# Altium schematic sheet Microcontroller.SchDoc
size A3; Organization: Altium Limited; Address1: L3, 12a Rodborough Rd; Address2: Frenchs Forest; Address3: NSW; Address4: Australia 2086
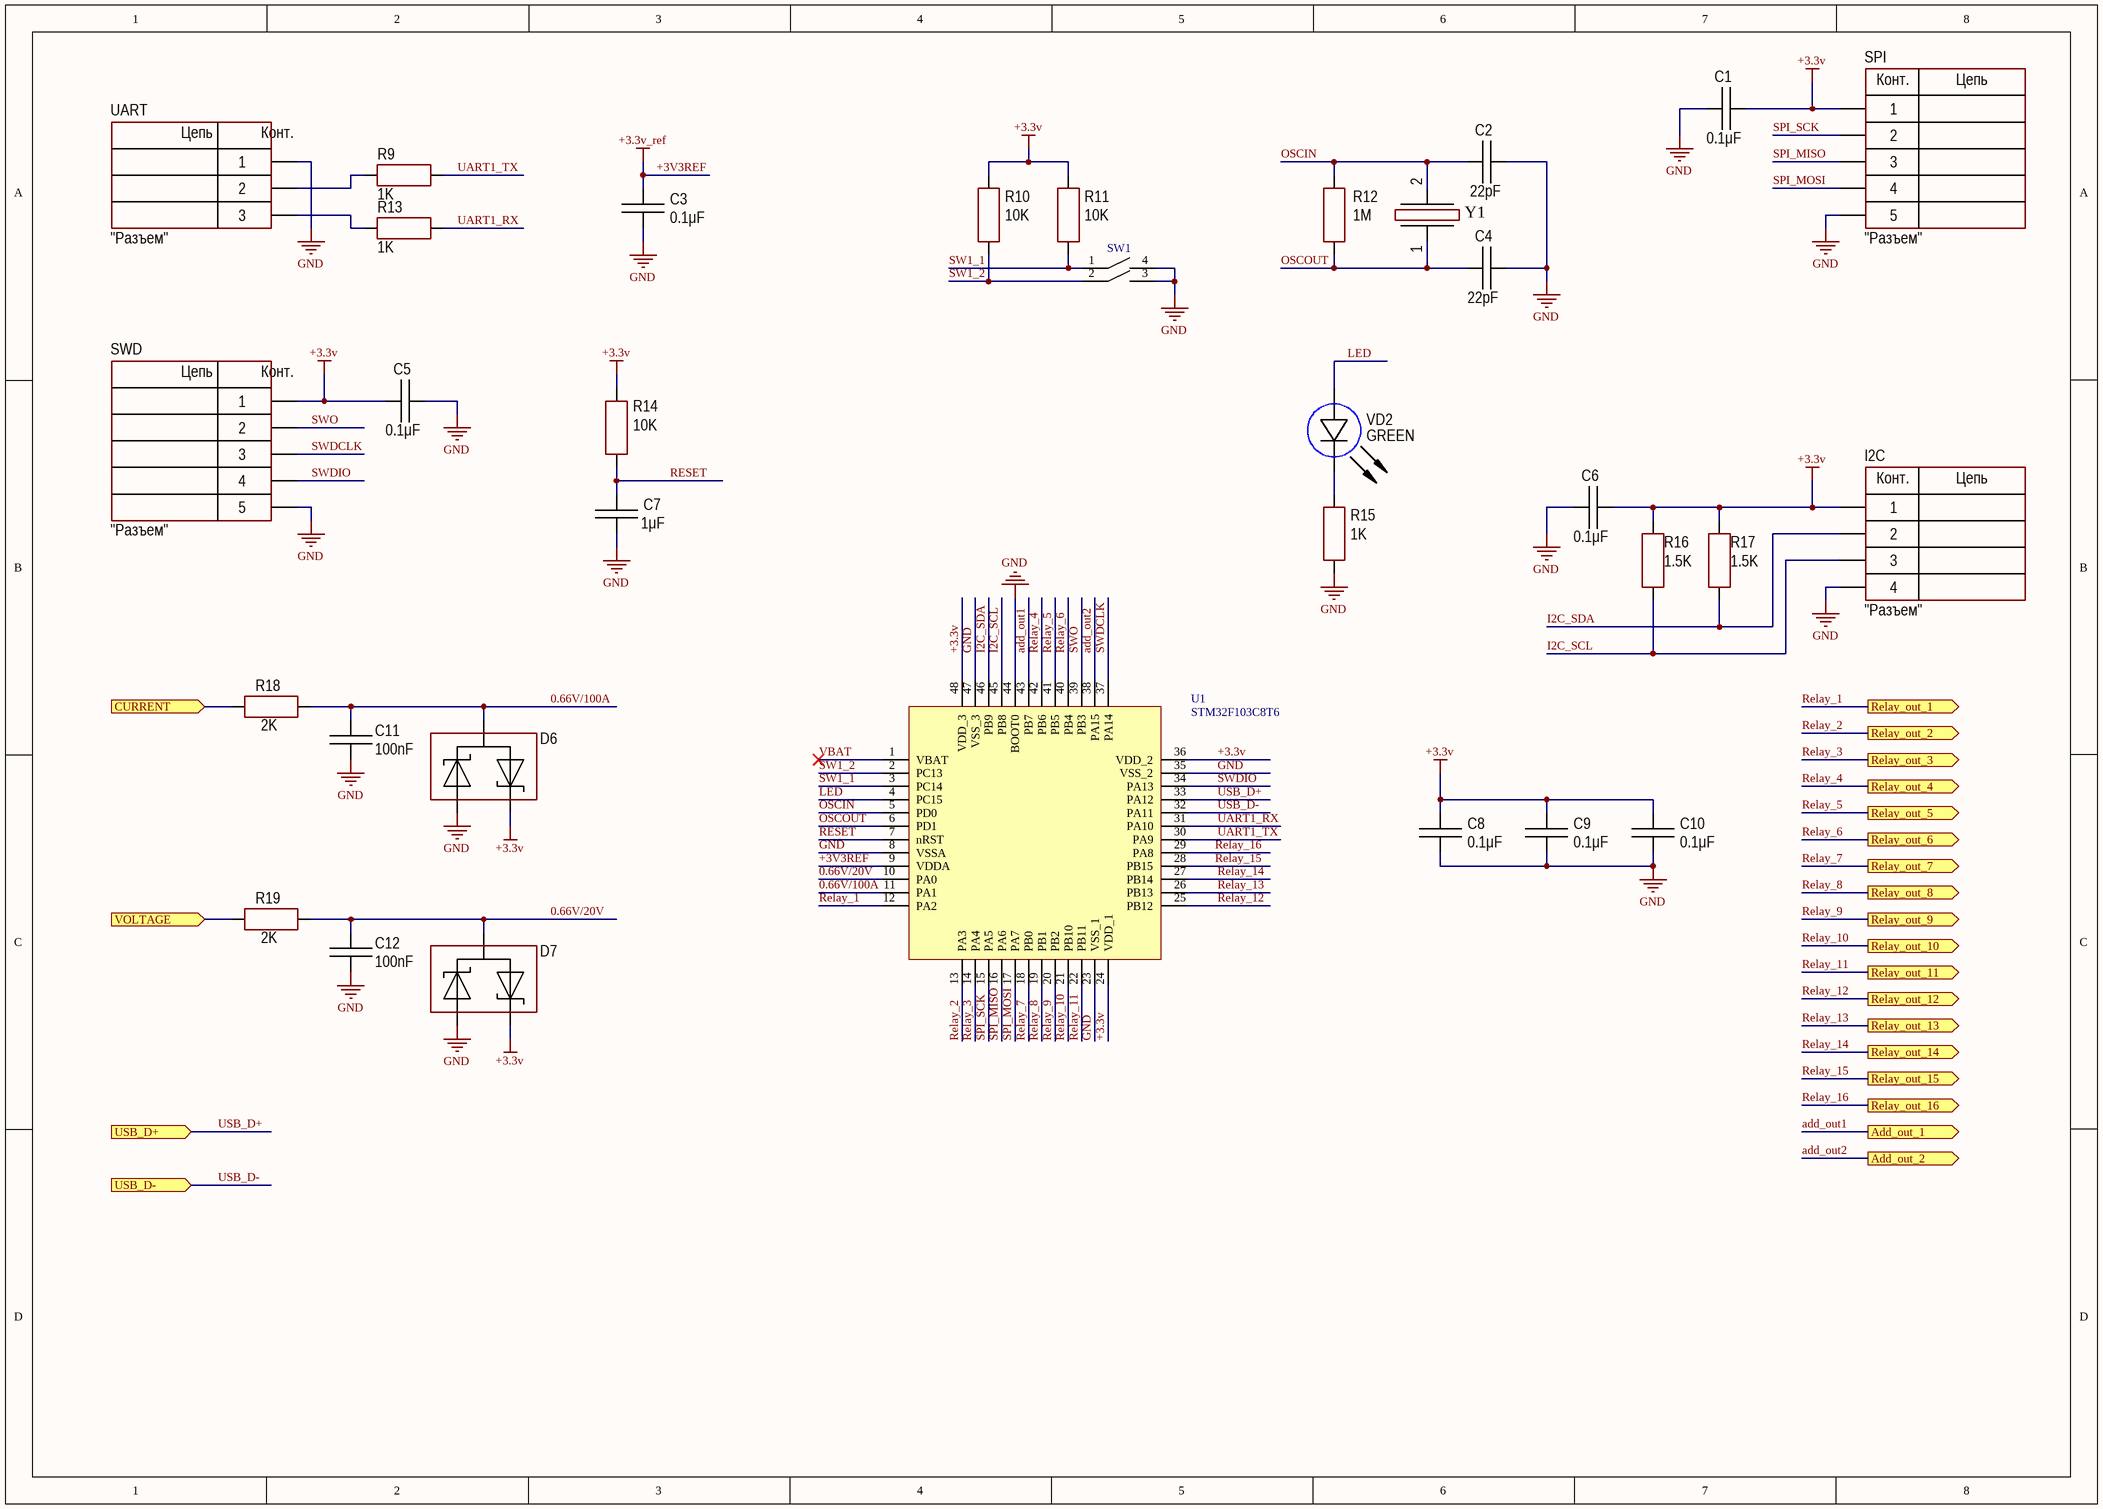
[diagram p0: Microcontroller.SchDoc]

## Parts
C1  value 0.1μF  [CAP: 1206]
C2  value 22pF  [CAP: 1206]
C3  value 0.1μF  [CAP: 1206]
C4  value 22pF  [CAP: 1206]
C5  value 0.1μF  [CAP: 1206]
C6  value 0.1μF  [CAP: 1206]
C7  value 1μF  [CAP: 1206]
C8  value 0.1μF  [CAP: 1206]
C9  value 0.1μF  [CAP: 1206]
C10  value 0.1μF  [CAP: 1206]
C11  value 100nF  [CAP: 1206]
C12  value 100nF  [CAP: 1206]
D6  (no value)  [SOT23]
D7  (no value)  [SOT23]
I2C  CommentText: "Разъем"  [CON: PLS-4]
R9  value 1K  [RES: 1206]
R10  value 10K  [RES: 1206]
R11  value 10K  [RES: 1206]
R12  value 1M  [RES: 1206]
R13  value 1K  [RES: 1206]
R14  value 10K  [RES: 1206]
R15  value 1K  [RES: 1206]
R16  value 1.5K  [RES: 1206]
R17  value 1.5K  [RES: 1206]
R18  value 2K  [RES: 1206]
R19  value 2K  [RES: 1206]
SPI  CommentText: "Разъем"  [CON: PLS-5]
SW1  (no value)  [DPL-2]
SWD  CommentText: "Разъем"  [CON: PLS-5]
U1  STM32F103C8T6  [48-LQFP]
UART  CommentText: "Разъем"  [CON: PLS-3]
VD2  Color: GREEN  [LED: 1206G]
Y1  (no value)  [HC49SM]

## Ports
Add_out_1 (out), Add_out_2 (out), CURRENT (in), Relay_out_1 (out), Relay_out_2 (out), Relay_out_3 (out), Relay_out_4 (out), Relay_out_5 (out), Relay_out_6 (out), Relay_out_7 (out), Relay_out_8 (out), Relay_out_9 (out), Relay_out_10 (out), Relay_out_11 (out), Relay_out_12 (out), Relay_out_13 (out), Relay_out_14 (out), Relay_out_15 (out), Relay_out_16 (out), USB_D+ (in), USB_D- (in), VOLTAGE (in)

## Nets
+3.3v: C1.2 C5.1 C6.2 C8.2 C9.2 C10.2 D6.2 D7.2 I2C.1 R10.2 R11.2 R14.2 R16.1 R17.1 SPI.1 SWD.1 U1.24(VDD_1) U1.36(VDD_2) U1.48(VDD_3)
+3V3REF: C3.2 U1.9(VDDA)  [also labelled +3.3v_ref]
GND: C1.1 C2.1 C3.1 C4.1 C5.2 C6.1 C7.1 C8.1 C9.1 C10.1 C11.1 C12.1 D6.1 D7.1 I2C.4 R15.1 SPI.5 SW1.3 SW1.4 SWD.5 U1.8(VSSA) U1.23(VSS_1) U1.35(VSS_2) U1.44(BOOT0) U1.47(VSS_3) UART.1
0.66V/20V: C12.2 D7.3 R19.1 U1.10(PA0)
0.66V/100A: C11.2 D6.3 R18.1 U1.11(PA1)
add_out1: U1.43(PB7) ; port Add_out_1
add_out2: U1.38(PA15) ; port Add_out_2
CURRENT: R18.2 ; port CURRENT
I2C_SCL: I2C.3 R16.2 U1.45(PB8)
I2C_SDA: I2C.2 R17.2 U1.46(PB9)
LED: U1.4(PC15) VD2.1(A)
OSCIN: C2.2 R12.2 U1.5(PD0) Y1.2
OSCOUT: C4.2 R12.1 U1.6(PD1) Y1.1
Relay_1: U1.12(PA2) ; port Relay_out_1
Relay_2: U1.13(PA3) ; port Relay_out_2
Relay_3: U1.14(PA4) ; port Relay_out_3
Relay_4: U1.42(PB6) ; port Relay_out_4
Relay_5: U1.41(PB5) ; port Relay_out_5
Relay_6: U1.40(PB4) ; port Relay_out_6
Relay_7: U1.18(PB0) ; port Relay_out_7
Relay_8: U1.19(PB1) ; port Relay_out_8
Relay_9: U1.20(PB2) ; port Relay_out_9
Relay_10: U1.21(PB10) ; port Relay_out_10
Relay_11: U1.22(PB11) ; port Relay_out_11
Relay_12: U1.25(PB12) ; port Relay_out_12
Relay_13: U1.26(PB13) ; port Relay_out_13
Relay_14: U1.27(PB14) ; port Relay_out_14
Relay_15: U1.28(PB15) ; port Relay_out_15
Relay_16: U1.29(PA8) ; port Relay_out_16
RESET: C7.2 R14.1 U1.7(nRST)
SPI_MISO: SPI.3 U1.16(PA6)
SPI_MOSI: SPI.4 U1.17(PA7)
SPI_SCK: SPI.2 U1.15(PA5)
SW1_1: R11.1 SW1.1 U1.3(PC14)
SW1_2: R10.1 SW1.2 U1.2(PC13)
SWDCLK: SWD.3 U1.37(PA14)
SWDIO: SWD.4 U1.34(PA13)
SWO: SWD.2 U1.39(PB3)
UART1_RX: R13.1 U1.31(PA10)
UART1_TX: R9.1 U1.30(PA9)
USB_D+: U1.33(PA12) ; port USB_D+
USB_D-: U1.32(PA11) ; port USB_D-
VBAT: U1.1(VBAT)
VOLTAGE: R19.2 ; port VOLTAGE
NetR9_2: R9.2 UART.2
NetR13_2: R13.2 UART.3
NetR15_2: R15.2 VD2.2(C)

## Notes on the sheet
- Title
- Size:
- Date:
- File:
- A0
- Number:
- Time:
- Revision:
- Sheet
- of
- (in symbol PLS-3) Цепь; Конт.
- (in symbol PLS-4) Конт.; Цепь
- (in symbol PLS-5) Цепь; Конт.

## Library data of the parts
C1 C3 C5 C6 C8-C10 = Ceramic_1206: Manufacturer: Yageo; PartNumber: CC1206KRX7R9BB104; ValueManufacturerPartNumber: Ceramic capacitor, 0.1μF, X7R, ±10%, 50V, 1206, -55...+125°C; TypeCapacitor: Ceramic capacitor; Tolerance: ±10%; TypeDielectric: X7R; Voltage: 50V; Package: 1206; HelpURL: https://www.digikey.com/product-detail/en/yageo/CC1206KRX7R9BB104/311-1179-1-ND/303089; Temperature: -55...+125°C
C2 C4 = Ceramic_1206: Manufacturer: Yageo; PartNumber: CC1206KRX7R9BB104; ValueManufacturerPartNumber: Ceramic capacitor, 22pF, X7R, ±10%, 50V, 1206, -55...+125°C; TypeCapacitor: Ceramic capacitor; Tolerance: ±10%; TypeDielectric: X7R; Voltage: 50V; Package: 1206; HelpURL: https://www.digikey.com/product-detail/en/yageo/CC1206KRX7R9BB104/311-1179-1-ND/303089; Temperature: -55...+125°C
C7 = Ceramic_1206: Manufacturer: Yageo; PartNumber: CC1206KRX7R9BB104; ValueManufacturerPartNumber: Ceramic capacitor, 1μF, X7R, ±10%, 50V, 1206, -55...+125°C; TypeCapacitor: Ceramic capacitor; Tolerance: ±10%; TypeDielectric: X7R; Voltage: 50V; Package: 1206; HelpURL: https://www.digikey.com/product-detail/en/yageo/CC1206KRX7R9BB104/311-1179-1-ND/303089; Temperature: -55...+125°C
C11 C12 = Ceramic_1206: Manufacturer: Yageo; PartNumber: CC1206KRX7R9BB104; ValueManufacturerPartNumber: Ceramic capacitor, 100nF, X7R, ±10%, 50V, 1206, -55...+125°C; TypeCapacitor: Ceramic capacitor; Tolerance: ±10%; TypeDielectric: X7R; Voltage: 50V; Package: 1206; HelpURL: https://www.digikey.com/product-detail/en/yageo/CC1206KRX7R9BB104/311-1179-1-ND/303089; Temperature: -55...+125°C
D6 D7 = Schottky_array: Manufacturer: Diodes Incorporated; ValueManufacturerPartNumber: BAS40-04, SOT23-3; PartNumber: BAS40-04; TypeDiode: Schottky array; Voltage: 40V; Current: 120mA; VoltageDrop: 1V; RecoveryTime: 15pF; Package: SOT23-3; HelpURL: https://www.digikey.com/product-detail/en/diodes-incorporated/MBR0580S1-7/MBR0580S1-7DICT-ND/5080371; Temperature: -55...+150°C
I2C = PLS-4: Manufacturer: Connfly; ValueManufacturerPartNumber: Connector, 4pin, 2.54mm, 500VAC, 3A; TypeConnector: Connector; VoltageMax: 500VAC; Pitch: 2.54mm; CurrentMax: 3A; Multichannel: 4pin; HelpURL: https://www.chipdip.ru/product/pls-4; PartNumber: PLS-4
R9 R13 R15 = Resistor_1206: Manufacturer: Yageo; PartNumber: RC1206JR-07100RL; ValueManufacturerPartNumber: Resistor film, 1K, ±5%, 1206, 0.25W, -55...+125°C; TypeResistor: Resistor film; Power: 0.25W; Tolerance: ±5%; Package: 1206; HelpURL: https://www.digikey.com/product-detail/en/yageo/RC1206JR-07100RL/311-100ERCT-ND/732153; Temperature: -55...+125°C
R10 R11 = Resistor_1206: Manufacturer: Yageo; PartNumber: RC1206JR-07100RL; ValueManufacturerPartNumber: Resistor, 10K, 1206; Power: 0.25W; Tolerance: ±5%; Package: 1206; HelpURL: https://www.digikey.com/product-detail/en/yageo/RC1206JR-07100RL/311-100ERCT-ND/732153; Temperature: -55...+125°C; TypeResistor: Resistor
R12 = Resistor_1206: Manufacturer: Yageo; PartNumber: RC1206JR-07100RL; ValueManufacturerPartNumber: Resistor film, 1M, ±5%, 1206, 0.25W, -55...+125°C; TypeResistor: Resistor film; Power: 0.25W; Tolerance: ±5%; Package: 1206; HelpURL: https://www.digikey.com/product-detail/en/yageo/RC1206JR-07100RL/311-100ERCT-ND/732153; Temperature: -55...+125°C
R14 = Resistor_1206: Manufacturer: Yageo; PartNumber: RC1206JR-07100RL; ValueManufacturerPartNumber: Resistor film, 10K, ±5%, 1206, 0.25W, -55...+125°C; TypeResistor: Resistor film; Power: 0.25W; Tolerance: ±5%; Package: 1206; HelpURL: https://www.digikey.com/product-detail/en/yageo/RC1206JR-07100RL/311-100ERCT-ND/732153; Temperature: -55...+125°C
R16 R17 = Resistor_1206: Manufacturer: Yageo; PartNumber: RC1206JR-07100RL; ValueManufacturerPartNumber: Resistor film, 1.5K, ±5%, 1206, 0.25W, -55...+125°C; TypeResistor: Resistor film; Power: 0.25W; Tolerance: ±5%; Package: 1206; HelpURL: https://www.digikey.com/product-detail/en/yageo/RC1206JR-07100RL/311-100ERCT-ND/732153; Temperature: -55...+125°C
R18 R19 = Resistor_1206: Manufacturer: Yageo; PartNumber: RC1206JR-07100RL; ValueManufacturerPartNumber: Resistor film, 2K, ±5%, 1206, 0.25W, -55...+125°C; TypeResistor: Resistor film; Power: 0.25W; Tolerance: ±5%; Package: 1206; HelpURL: https://www.digikey.com/product-detail/en/yageo/RC1206JR-07100RL/311-100ERCT-ND/732153; Temperature: -55...+125°C
SPI SWD = PLS-5: Manufacturer: Connfly; ValueManufacturerPartNumber: Connector, 5pin, 2.54mm, 500VAC, 3A; TypeConnector: Connector; VoltageMax: 500VAC; Pitch: 2.54mm; CurrentMax: 3A; Multichannel: 5pin; HelpURL: https://www.chipdip.ru/product/pls-5; PartNumber: PLS-5
SW1 = NDP-02: ValueManufacturerPartNumber: NDP-02, DPL-02; Package: DPL-02; PartNumber: NDP-02
UART = PLS-3: Manufacturer: Connfly; ValueManufacturerPartNumber: Connector, 3pin, 2.54mm, 500VAC, 3A; TypeConnector: Connector; VoltageMax: 500VAC; Pitch: 2.54mm; CurrentMax: 3A; Multichannel: 3pin; HelpURL: https://www.chipdip.ru/product/pls-3; PartNumber: PLS-3
VD2 = LED_single: ValueManufacturerPartNumber: LED, Green, *, *, *, -55...+150°C; TypeDiode: LED; Manufacturer: *; Package: *; HelpURL: *; Temperature: -55...+150°C; Current: *; VoltageDrop: *; PartNumber: *; ColorParameter: Green
Y1 = HC49SM: PartNumber: HC49SM-16.000MHZ-20PF; ValueManufacturerPartNumber: HC49SM-16.000MHZ-20PF, HC49SM; Package: HC49SM